# Altium schematic sheet SOM.SchDoc: =SheetTitle_Top
size 420 x 297 mm; EDA_Number: ARTIQ; Author: G.Kasprowicz; CompanyName: WUT ISE; DrawnBy: G.Kasprowicz; Organization: WUT ISE; Address1: PW ISE; Address2: Nowowiejska 15/19 00-665 Warsaw; Address3: gkasprow@gmail.com; ModifiedBy: -; CheckedDate: -; Title2: SOM; DivGrp: WUT ISE; Designer: G.Kasprowicz; ModifiedDate: -; ProjectName: Sensor Box
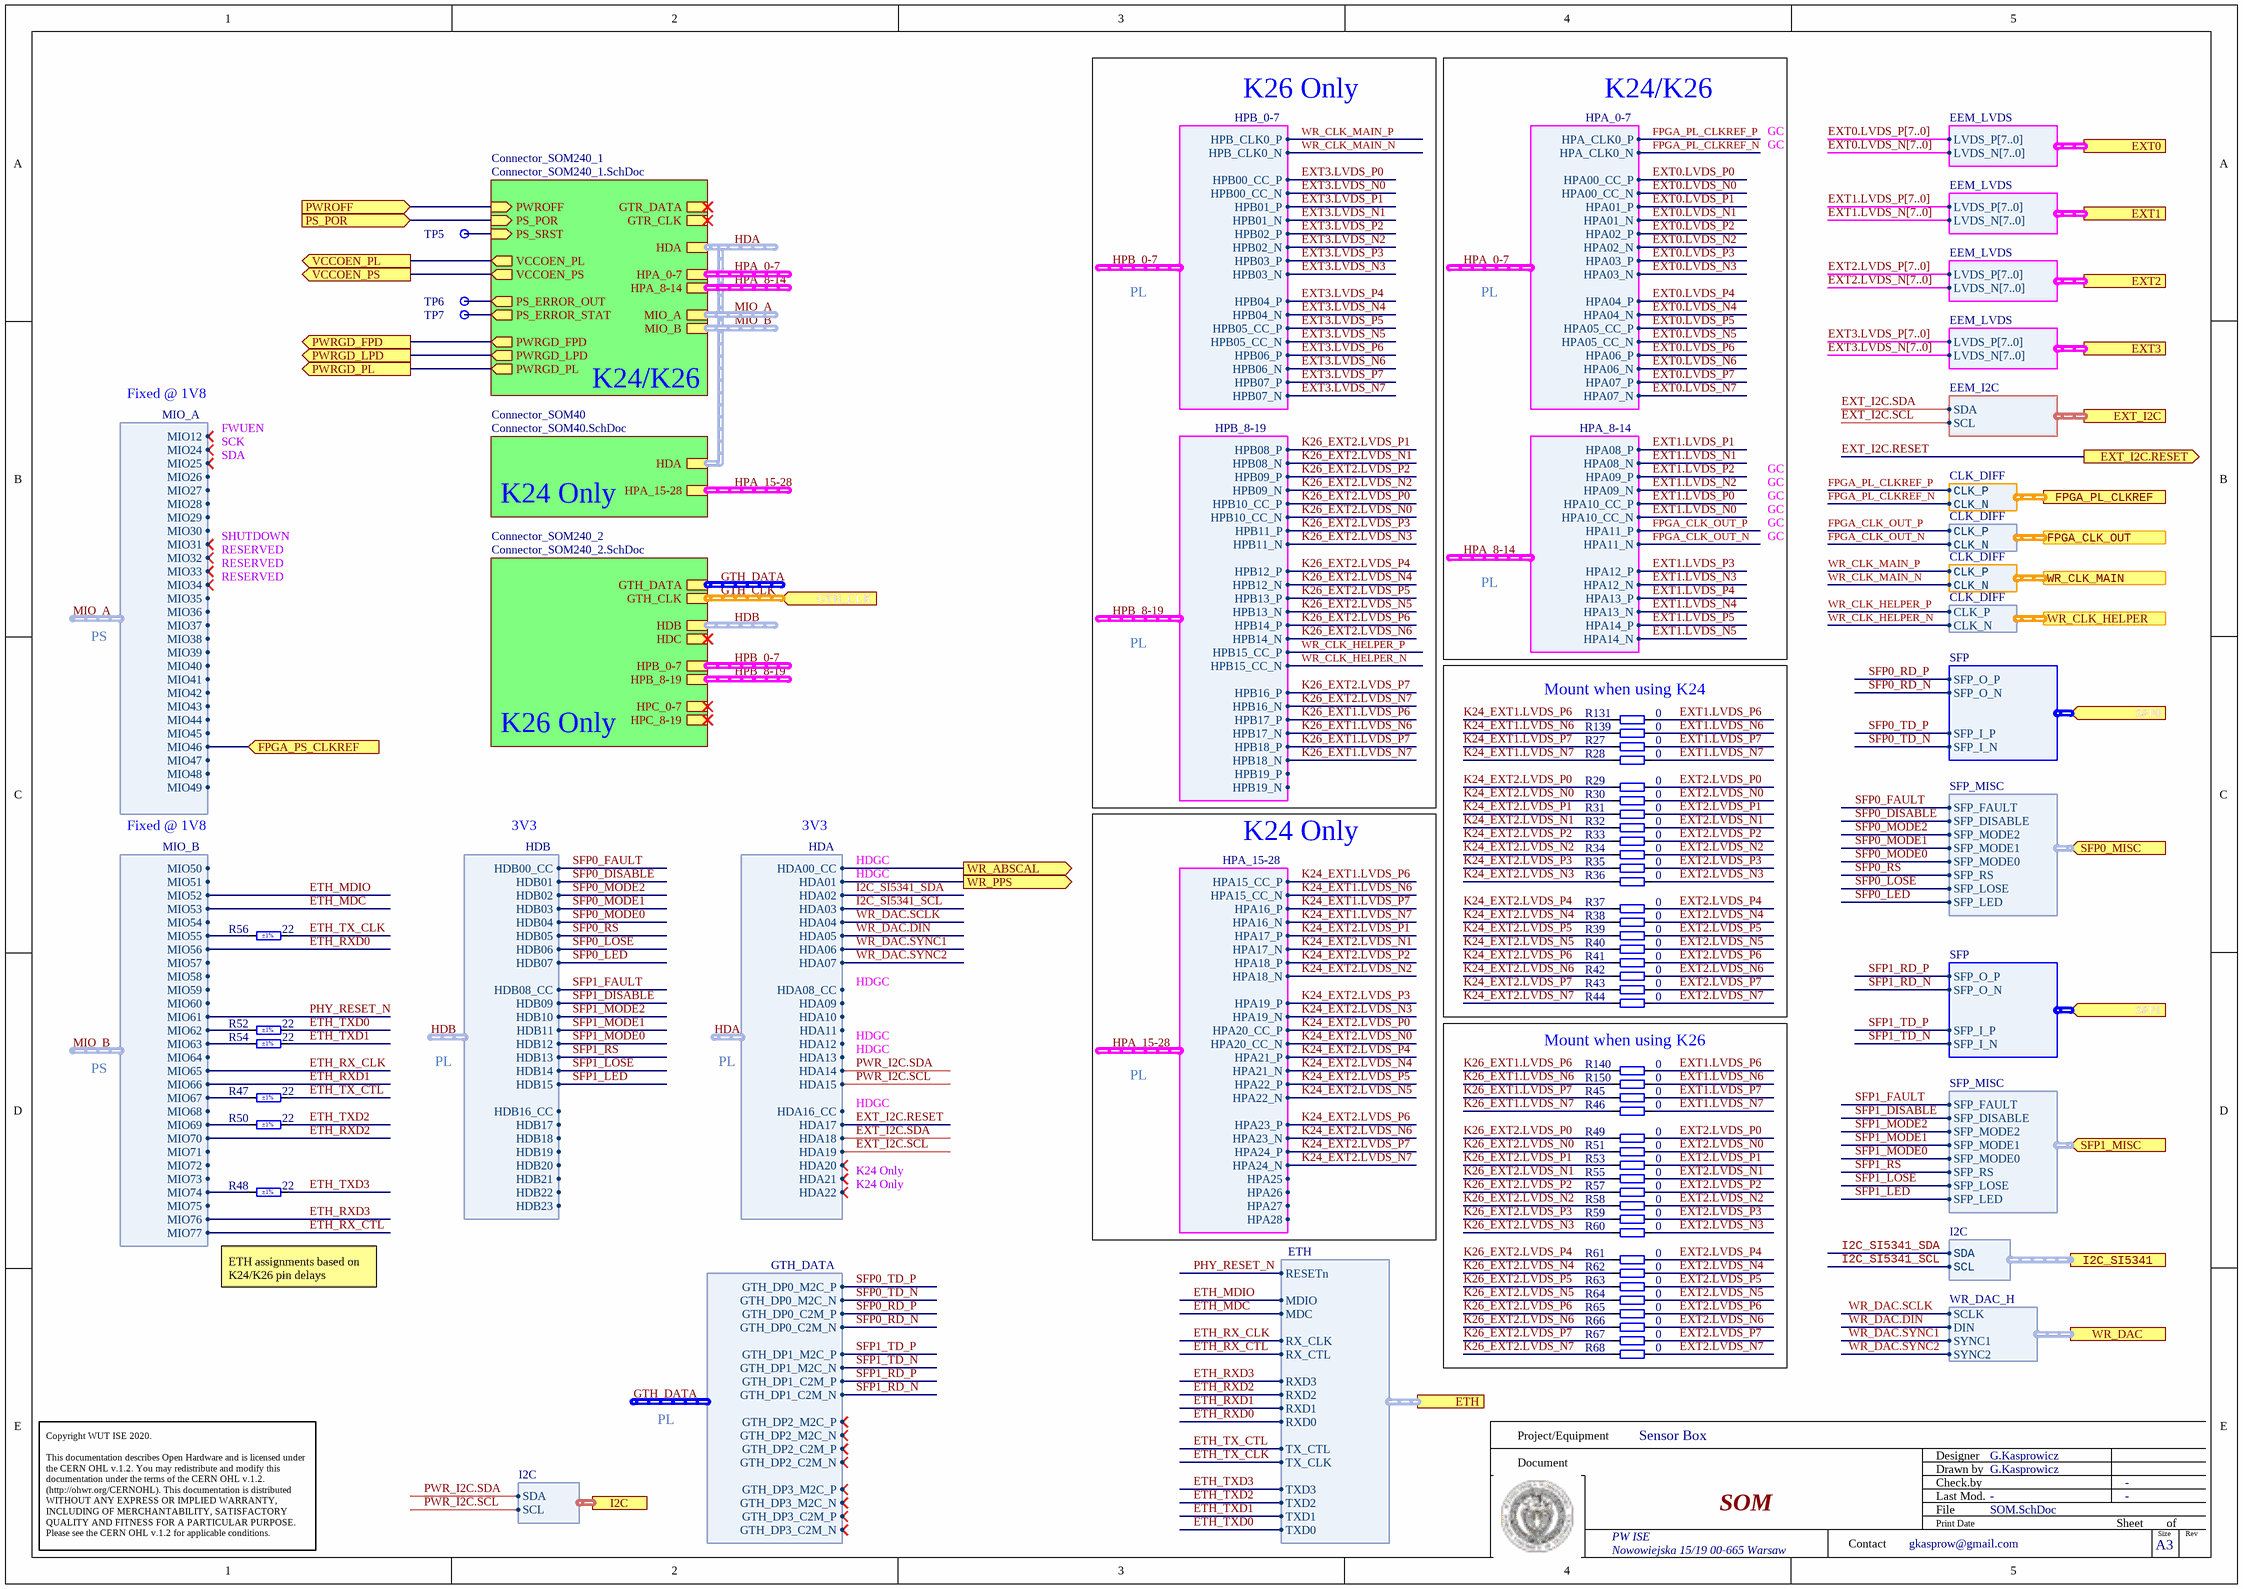
[diagram p0: SOM.SchDoc]

## Parts
R27  0  [RESC1005X40N]
R28  0  [RESC1005X40N]
R29  0  [RESC1005X40N]
R30  0  [RESC1005X40N]
R31  0  [RESC1005X40N]
R32  0  [RESC1005X40N]
R33  0  [RESC1005X40N]
R34  0  [RESC1005X40N]
R35  0  [RESC1005X40N]
R36  0  [RESC1005X40N]
R37  0  [RESC1005X40N]
R38  0  [RESC1005X40N]
R39  0  [RESC1005X40N]
R40  0  [RESC1005X40N]
R41  0  [RESC1005X40N]
R42  0  [RESC1005X40N]
R43  0  [RESC1005X40N]
R44  0  [RESC1005X40N]
R45  0  [RESC1005X40N]
R46  0  [RESC1005X40N]
R47  22  Tolerance: ±1%  [RESC1005X40N]
R48  22  Tolerance: ±1%  [RESC1005X40N]
R49  0  [RESC1005X40N]
R50  22  Tolerance: ±1%  [RESC1005X40N]
R51  0  [RESC1005X40N]
R52  22  Tolerance: ±1%  [RESC1005X40N]
R53  0  [RESC1005X40N]
R54  22  Tolerance: ±1%  [RESC1005X40N]
R55  0  [RESC1005X40N]
R56  22  Tolerance: ±1%  [RESC1005X40N]
R57  0  [RESC1005X40N]
R58  0  [RESC1005X40N]
R59  0  [RESC1005X40N]
R60  0  [RESC1005X40N]
R61  0  [RESC1005X40N]
R62  0  [RESC1005X40N]
R63  0  [RESC1005X40N]
R64  0  [RESC1005X40N]
R65  0  [RESC1005X40N]
R66  0  [RESC1005X40N]
R67  0  [RESC1005X40N]
R68  0  [RESC1005X40N]
R131  0  [RESC1005X40N]
R139  0  [RESC1005X40N]
R140  0  [RESC1005X40N]
R150  0  [RESC1005X40N]
TP5  Test Point  [TPS127]  (value not drawn)  (no BOM)
TP6  Test Point  [TPS127]  (value not drawn)  (no BOM)
TP7  Test Point  [TPS127]  (value not drawn)  (no BOM)

## Blocks framed on the sheet
Mount when using K24: R27-R44 R131 R139
Mount when using K26: R45 R46 R49 R51 R53 R55 R57-R68 R140 R150

## Sub-sheets
Connector_SOM40 = Connector_SOM40.SchDoc: HDA (harness HDA), HPA_15-28 (harness HPA_15-28)
Connector_SOM240_1 = Connector_SOM240_1.SchDoc: VCCOEN_PS (out), VCCOEN_PL (out), PS_ERROR_OUT (out), PS_ERROR_STAT (out), PWROFF (in), PS_POR (in), PS_SRST (in), PWRGD_FPD (out), PWRGD_LPD (out), PWRGD_PL (out), GTR_DATA (harness GTR_DATA), GTR_CLK (harness GTR_CLK), HDA (harness HDA), HPA_0-7 (harness HPA_0-7), HPA_8-14 (harness HPA_8-14), MIO_A (harness MIO_A), MIO_B (harness MIO_B)
Connector_SOM240_2 = Connector_SOM240_2.SchDoc: HDB (harness HDB), HDC (harness HDC), GTH_DATA (harness GTH_DATA), GTH_CLK (harness GTH_CLK), HPB_0-7 (harness HPB_0-7), HPB_8-19 (harness HPB_8-19), HPC_0-7 (harness HPC_0-7), HPC_8-19 (harness HPC_8-19)

## Ports
ETH (harness ETH), EXT0 (harness EEM_LVDS), EXT1 (harness EEM_LVDS), EXT2 (harness EEM_LVDS), EXT3 (harness EEM_LVDS), EXT_I2C (harness EEM_I2C), EXT_I2C.RESET (out), FPGA_CLK_OUT (harness CLK_DIFF), FPGA_PL_CLKREF (harness CLK_DIFF), FPGA_PS_CLKREF (in), GTH_CLK (in, harness GTH_CLK), I2C (harness I2C), I2C_SI5341 (harness I2C), PS_POR (in), PWRGD_FPD (out), PWRGD_LPD (out), PWRGD_PL (out), PWROFF (in), SFP0 (in, harness SFP), SFP0_MISC (in, harness SFP_MISC), SFP1 (in, harness SFP), SFP1_MISC (in, harness SFP_MISC), VCCOEN_PL (out), VCCOEN_PS (out), WR_ABSCAL (out), WR_CLK_HELPER (harness CLK_DIFF), WR_CLK_MAIN (harness CLK_DIFF), WR_DAC (harness WR_DAC_H), WR_PPS (out)

## Harnesses
SFP_MISC: SFP_FAULT, SFP_DISABLE, SFP_MODE2, SFP_MODE1, SFP_MODE0, SFP_RS, SFP_LOSE, SFP_LED
SFP: SFP_O_P, SFP_O_N, SFP_I_P, SFP_I_N
GTH_DATA: GTH_DP0_M2C_P, GTH_DP0_M2C_N, GTH_DP0_C2M_P, GTH_DP0_C2M_N, GTH_DP1_M2C_P, GTH_DP1_M2C_N, GTH_DP1_C2M_P, GTH_DP1_C2M_N, GTH_DP2_M2C_P, GTH_DP2_M2C_N, GTH_DP2_C2M_P, GTH_DP2_C2M_N, GTH_DP3_M2C_P, GTH_DP3_M2C_N, GTH_DP3_C2M_P, GTH_DP3_C2M_N
HPA_0-7: HPA_CLK0_P, HPA_CLK0_N, HPA00_CC_P, HPA00_CC_N, HPA01_P, HPA01_N, HPA02_P, HPA02_N, HPA03_P, HPA03_N, HPA04_P, HPA04_N, HPA05_CC_P, HPA05_CC_N, HPA06_P, HPA06_N, HPA07_P, HPA07_N
HPA_8-14: HPA08_P, HPA08_N, HPA09_P, HPA09_N, HPA10_CC_P, HPA10_CC_N, HPA11_P, HPA11_N, HPA12_P, HPA12_N, HPA13_P, HPA13_N, HPA14_P, HPA14_N
EEM_LVDS: LVDS_N[7..0], LVDS_P[7..0]
EEM_I2C: SCL, SDA
HPB_0-7: HPB_CLK0_P, HPB_CLK0_N, HPB00_CC_P, HPB00_CC_N, HPB01_P, HPB01_N, HPB02_P, HPB02_N, HPB03_P, HPB03_N, HPB04_P, HPB04_N, HPB05_CC_P, HPB05_CC_N, HPB06_P, HPB06_N, HPB07_P, HPB07_N
HPB_8-19: HPB08_P, HPB08_N, HPB09_P, HPB09_N, HPB10_CC_P, HPB10_CC_N, HPB11_P, HPB11_N, HPB12_P, HPB12_N, HPB13_P, HPB13_N, HPB14_P, HPB14_N, HPB15_CC_P, HPB15_CC_N, HPB16_P, HPB16_N, HPB17_P, HPB17_N, HPB18_P, HPB18_N, HPB19_P, HPB19_N
HPA_15-28: HPA15_CC_P, HPA15_CC_N, HPA16_P, HPA16_N, HPA17_P, HPA17_N, HPA18_P, HPA18_N, HPA19_P, HPA19_N, HPA20_CC_P, HPA20_CC_N, HPA21_P, HPA21_N, HPA22_P, HPA22_N, HPA23_P, HPA23_N, HPA24_P, HPA24_N, HPA25, HPA26, HPA27, HPA28
HDA: HDA00_CC, HDA01, HDA02, HDA03, HDA04, HDA06, HDA07, HDA05, HDA08_CC, HDA09, HDA10, HDA11, HDA12, HDA13, HDA14, HDA15, HDA16_CC, HDA17, HDA18, HDA19, HDA20, HDA21, HDA22
ETH: RXD3, RXD2, RX_CLK, RX_CTL, RXD1, RXD0, TX_CTL, TX_CLK, TXD3, TXD2, TXD1, TXD0, MDIO, MDC, RESETn
MIO_A: MIO12, MIO24, MIO25, MIO26, MIO27, MIO28, MIO29, MIO30, MIO31, MIO32, MIO33, MIO34, MIO35, MIO36, MIO37, MIO38, MIO39, MIO40, MIO41, MIO42, MIO43, MIO44, MIO45, MIO46, MIO47, MIO48, MIO49
CLK_DIFF: CLK_N, CLK_P
CLK_DIFF: CLK_P, CLK_N
I2C: SCL, SDA
WR_DAC_H: SYNC1, SCLK, SYNC2, DIN
HDB: HDB00_CC, HDB01, HDB02, HDB03, HDB04, HDB05, HDB06, HDB07, HDB08_CC, HDB09, HDB10, HDB11, HDB12, HDB13, HDB14, HDB15, HDB16_CC, HDB17, HDB18, HDB19, HDB20, HDB21, HDB22, HDB23
MIO_B: MIO50, MIO51, MIO52, MIO53, MIO54, MIO55, MIO56, MIO57, MIO58, MIO59, MIO60, MIO61, MIO62, MIO63, MIO64, MIO65, MIO66, MIO67, MIO68, MIO69, MIO70, MIO71, MIO72, MIO73, MIO74, MIO75, MIO76, MIO77

## Nets
ETH_MDC: port ETH.MDC, sheet Connector_SOM240_1/MIO_B.MIO53
ETH_MDIO: port ETH.MDIO, sheet Connector_SOM240_1/MIO_B.MIO52
ETH_RX_CLK: port ETH.RX_CLK, sheet Connector_SOM240_1/MIO_B.MIO65
ETH_RX_CTL: port ETH.RX_CTL, sheet Connector_SOM240_1/MIO_B.MIO77
ETH_RXD0: port ETH.RXD0, sheet Connector_SOM240_1/MIO_B.MIO56
ETH_RXD1: port ETH.RXD1, sheet Connector_SOM240_1/MIO_B.MIO66
ETH_RXD2: port ETH.RXD2, sheet Connector_SOM240_1/MIO_B.MIO70
ETH_RXD3: port ETH.RXD3, sheet Connector_SOM240_1/MIO_B.MIO76
ETH_TX_CLK: R56.2 ; port ETH.TX_CLK
ETH_TX_CTL: R47.2 ; port ETH.TX_CTL
ETH_TXD0: R52.2 ; port ETH.TXD0
ETH_TXD1: R54.2 ; port ETH.TXD1
ETH_TXD2: R50.2 ; port ETH.TXD2
ETH_TXD3: R48.2 ; port ETH.TXD3
EXT0.LVDS_N0: sheet Connector_SOM240_1/HPA_0-7.HPA00_CC_N
EXT0.LVDS_N1: sheet Connector_SOM240_1/HPA_0-7.HPA01_N
EXT0.LVDS_N2: sheet Connector_SOM240_1/HPA_0-7.HPA02_N
EXT0.LVDS_N3: sheet Connector_SOM240_1/HPA_0-7.HPA03_N
EXT0.LVDS_N4: sheet Connector_SOM240_1/HPA_0-7.HPA04_N
EXT0.LVDS_N5: sheet Connector_SOM240_1/HPA_0-7.HPA05_CC_N
EXT0.LVDS_N6: sheet Connector_SOM240_1/HPA_0-7.HPA06_N
EXT0.LVDS_N7: sheet Connector_SOM240_1/HPA_0-7.HPA07_N
EXT0.LVDS_P0: sheet Connector_SOM240_1/HPA_0-7.HPA00_CC_P
EXT0.LVDS_P1: sheet Connector_SOM240_1/HPA_0-7.HPA01_P
EXT0.LVDS_P2: sheet Connector_SOM240_1/HPA_0-7.HPA02_P
EXT0.LVDS_P3: sheet Connector_SOM240_1/HPA_0-7.HPA03_P
EXT0.LVDS_P4: sheet Connector_SOM240_1/HPA_0-7.HPA04_P
EXT0.LVDS_P5: sheet Connector_SOM240_1/HPA_0-7.HPA05_CC_P
EXT0.LVDS_P6: sheet Connector_SOM240_1/HPA_0-7.HPA06_P
EXT0.LVDS_P7: sheet Connector_SOM240_1/HPA_0-7.HPA07_P
EXT1.LVDS_N0: sheet Connector_SOM240_1/HPA_8-14.HPA10_CC_N
EXT1.LVDS_N1: sheet Connector_SOM240_1/HPA_8-14.HPA08_N
EXT1.LVDS_N2: sheet Connector_SOM240_1/HPA_8-14.HPA09_N
EXT1.LVDS_N3: sheet Connector_SOM240_1/HPA_8-14.HPA12_N
EXT1.LVDS_N4: sheet Connector_SOM240_1/HPA_8-14.HPA13_N
EXT1.LVDS_N5: sheet Connector_SOM240_1/HPA_8-14.HPA14_N
EXT1.LVDS_N6: R139.2 R150.2
EXT1.LVDS_N7: R28.2 R46.2
EXT1.LVDS_P0: sheet Connector_SOM240_1/HPA_8-14.HPA10_CC_P
EXT1.LVDS_P1: sheet Connector_SOM240_1/HPA_8-14.HPA08_P
EXT1.LVDS_P2: sheet Connector_SOM240_1/HPA_8-14.HPA09_P
EXT1.LVDS_P3: sheet Connector_SOM240_1/HPA_8-14.HPA12_P
EXT1.LVDS_P4: sheet Connector_SOM240_1/HPA_8-14.HPA13_P
EXT1.LVDS_P5: sheet Connector_SOM240_1/HPA_8-14.HPA14_P
EXT1.LVDS_P6: R131.2 R140.2
EXT1.LVDS_P7: R27.2 R45.2
EXT2.LVDS_N0: R30.2 R51.2
EXT2.LVDS_N1: R32.2 R55.2
EXT2.LVDS_N2: R34.2 R58.2
EXT2.LVDS_N3: R36.2 R60.2
EXT2.LVDS_N4: R38.2 R62.2
EXT2.LVDS_N5: R40.2 R64.2
EXT2.LVDS_N6: R42.2 R66.2
EXT2.LVDS_N7: R44.2 R68.2
EXT2.LVDS_P0: R29.2 R49.2
EXT2.LVDS_P1: R31.2 R53.2
EXT2.LVDS_P2: R33.2 R57.2
EXT2.LVDS_P3: R35.2 R59.2
EXT2.LVDS_P4: R37.2 R61.2
EXT2.LVDS_P5: R39.2 R63.2
EXT2.LVDS_P6: R41.2 R65.2
EXT2.LVDS_P7: R43.2 R67.2
EXT3.LVDS_N0: sheet Connector_SOM240_2/HPB_0-7.HPB00_CC_N
EXT3.LVDS_N1: sheet Connector_SOM240_2/HPB_0-7.HPB01_N
EXT3.LVDS_N2: sheet Connector_SOM240_2/HPB_0-7.HPB02_N
EXT3.LVDS_N3: sheet Connector_SOM240_2/HPB_0-7.HPB03_N
EXT3.LVDS_N4: sheet Connector_SOM240_2/HPB_0-7.HPB04_N
EXT3.LVDS_N5: sheet Connector_SOM240_2/HPB_0-7.HPB05_CC_N
EXT3.LVDS_N6: sheet Connector_SOM240_2/HPB_0-7.HPB06_N
EXT3.LVDS_N7: sheet Connector_SOM240_2/HPB_0-7.HPB07_N
EXT3.LVDS_P0: sheet Connector_SOM240_2/HPB_0-7.HPB00_CC_P
EXT3.LVDS_P1: sheet Connector_SOM240_2/HPB_0-7.HPB01_P
EXT3.LVDS_P2: sheet Connector_SOM240_2/HPB_0-7.HPB02_P
EXT3.LVDS_P3: sheet Connector_SOM240_2/HPB_0-7.HPB03_P
EXT3.LVDS_P4: sheet Connector_SOM240_2/HPB_0-7.HPB04_P
EXT3.LVDS_P5: sheet Connector_SOM240_2/HPB_0-7.HPB05_CC_P
EXT3.LVDS_P6: sheet Connector_SOM240_2/HPB_0-7.HPB06_P
EXT3.LVDS_P7: sheet Connector_SOM240_2/HPB_0-7.HPB07_P
EXT_I2C.RESET: port EXT_I2C.RESET, sheet Connector_SOM240_1/HDA.HDA17
EXT_I2C.SCL: port EXT_I2C.SCL, sheet Connector_SOM240_1/HDA.HDA19
EXT_I2C.SDA: port EXT_I2C.SDA, sheet Connector_SOM240_1/HDA.HDA18
FPGA_CLK_OUT_N: sheet Connector_SOM240_1/HPA_8-14.HPA11_N, port FPGA_CLK_OUT.CLK_N
FPGA_CLK_OUT_P: sheet Connector_SOM240_1/HPA_8-14.HPA11_P, port FPGA_CLK_OUT.CLK_P
FPGA_PL_CLKREF_N: sheet Connector_SOM240_1/HPA_0-7.HPA_CLK0_N, port FPGA_PL_CLKREF.CLK_N
FPGA_PL_CLKREF_P: sheet Connector_SOM240_1/HPA_0-7.HPA_CLK0_P, port FPGA_PL_CLKREF.CLK_P
HDA.HDA00_CC: port WR_ABSCAL, sheet Connector_SOM240_1/HDA.HDA00_CC
HDA.HDA01: port WR_PPS, sheet Connector_SOM240_1/HDA.HDA01
I2C_SI5341_SCL: sheet Connector_SOM240_1/HDA.HDA03, port I2C_SI5341.SCL  [project net HDA.HDA03]
I2C_SI5341_SDA: sheet Connector_SOM240_1/HDA.HDA02, port I2C_SI5341.SDA  [project net HDA.HDA02]
K24_EXT1.LVDS_N6: R139.1 ; sheet Connector_SOM40/HPA_15-28.HPA15_CC_N  [project net HPA_15-28.HPA15_CC_N]
K24_EXT1.LVDS_N7: R28.1 ; sheet Connector_SOM40/HPA_15-28.HPA16_N  [project net HPA_15-28.HPA16_N]
K24_EXT1.LVDS_P6: R131.1 ; sheet Connector_SOM40/HPA_15-28.HPA15_CC_P  [project net HPA_15-28.HPA15_CC_P]
K24_EXT1.LVDS_P7: R27.1 ; sheet Connector_SOM40/HPA_15-28.HPA16_P  [project net HPA_15-28.HPA16_P]
K24_EXT2.LVDS_N0: R30.1 ; sheet Connector_SOM40/HPA_15-28.HPA20_CC_N  [project net HPA_15-28.HPA20_CC_N]
K24_EXT2.LVDS_N1: R32.1 ; sheet Connector_SOM40/HPA_15-28.HPA17_N  [project net HPA_15-28.HPA17_N]
K24_EXT2.LVDS_N2: R34.1 ; sheet Connector_SOM40/HPA_15-28.HPA18_N  [project net HPA_15-28.HPA18_N]
K24_EXT2.LVDS_N3: R36.1 ; sheet Connector_SOM40/HPA_15-28.HPA19_N  [project net HPA_15-28.HPA19_N]
K24_EXT2.LVDS_N4: R38.1 ; sheet Connector_SOM40/HPA_15-28.HPA21_N  [project net HPA_15-28.HPA21_N]
K24_EXT2.LVDS_N5: R40.1 ; sheet Connector_SOM40/HPA_15-28.HPA22_N  [project net HPA_15-28.HPA22_N]
K24_EXT2.LVDS_N6: R42.1 ; sheet Connector_SOM40/HPA_15-28.HPA23_N  [project net HPA_15-28.HPA23_N]
K24_EXT2.LVDS_N7: R44.1 ; sheet Connector_SOM40/HPA_15-28.HPA24_N  [project net HPA_15-28.HPA24_N]
K24_EXT2.LVDS_P0: R29.1 ; sheet Connector_SOM40/HPA_15-28.HPA20_CC_P  [project net HPA_15-28.HPA20_CC_P]
K24_EXT2.LVDS_P1: R31.1 ; sheet Connector_SOM40/HPA_15-28.HPA17_P  [project net HPA_15-28.HPA17_P]
K24_EXT2.LVDS_P2: R33.1 ; sheet Connector_SOM40/HPA_15-28.HPA18_P  [project net HPA_15-28.HPA18_P]
K24_EXT2.LVDS_P3: R35.1 ; sheet Connector_SOM40/HPA_15-28.HPA19_P  [project net HPA_15-28.HPA19_P]
K24_EXT2.LVDS_P4: R37.1 ; sheet Connector_SOM40/HPA_15-28.HPA21_P  [project net HPA_15-28.HPA21_P]
K24_EXT2.LVDS_P5: R39.1 ; sheet Connector_SOM40/HPA_15-28.HPA22_P  [project net HPA_15-28.HPA22_P]
K24_EXT2.LVDS_P6: R41.1 ; sheet Connector_SOM40/HPA_15-28.HPA23_P  [project net HPA_15-28.HPA23_P]
K24_EXT2.LVDS_P7: R43.1 ; sheet Connector_SOM40/HPA_15-28.HPA24_P  [project net HPA_15-28.HPA24_P]
K26_EXT1.LVDS_N6: R150.1 ; sheet Connector_SOM240_2/HPB_8-19.HPB17_N  [project net HPB_8-19.HPB17_N]
K26_EXT1.LVDS_N7: R46.1 ; sheet Connector_SOM240_2/HPB_8-19.HPB18_N  [project net HPB_8-19.HPB18_N]
K26_EXT1.LVDS_P6: R140.1 ; sheet Connector_SOM240_2/HPB_8-19.HPB17_P  [project net HPB_8-19.HPB17_P]
K26_EXT1.LVDS_P7: R45.1 ; sheet Connector_SOM240_2/HPB_8-19.HPB18_P  [project net HPB_8-19.HPB18_P]
K26_EXT2.LVDS_N0: R51.1 ; sheet Connector_SOM240_2/HPB_8-19.HPB10_CC_N  [project net HPB_8-19.HPB10_CC_N]
K26_EXT2.LVDS_N1: R55.1 ; sheet Connector_SOM240_2/HPB_8-19.HPB08_N  [project net HPB_8-19.HPB08_N]
K26_EXT2.LVDS_N2: R58.1 ; sheet Connector_SOM240_2/HPB_8-19.HPB09_N  [project net HPB_8-19.HPB09_N]
K26_EXT2.LVDS_N3: R60.1 ; sheet Connector_SOM240_2/HPB_8-19.HPB11_N  [project net HPB_8-19.HPB11_N]
K26_EXT2.LVDS_N4: R62.1 ; sheet Connector_SOM240_2/HPB_8-19.HPB12_N  [project net HPB_8-19.HPB12_N]
K26_EXT2.LVDS_N5: R64.1 ; sheet Connector_SOM240_2/HPB_8-19.HPB13_N  [project net HPB_8-19.HPB13_N]
K26_EXT2.LVDS_N6: R66.1 ; sheet Connector_SOM240_2/HPB_8-19.HPB14_N  [project net HPB_8-19.HPB14_N]
K26_EXT2.LVDS_N7: R68.1 ; sheet Connector_SOM240_2/HPB_8-19.HPB16_N  [project net HPB_8-19.HPB16_N]
K26_EXT2.LVDS_P0: R49.1 ; sheet Connector_SOM240_2/HPB_8-19.HPB10_CC_P  [project net HPB_8-19.HPB10_CC_P]
K26_EXT2.LVDS_P1: R53.1 ; sheet Connector_SOM240_2/HPB_8-19.HPB08_P  [project net HPB_8-19.HPB08_P]
K26_EXT2.LVDS_P2: R57.1 ; sheet Connector_SOM240_2/HPB_8-19.HPB09_P  [project net HPB_8-19.HPB09_P]
K26_EXT2.LVDS_P3: R59.1 ; sheet Connector_SOM240_2/HPB_8-19.HPB11_P  [project net HPB_8-19.HPB11_P]
K26_EXT2.LVDS_P4: R61.1 ; sheet Connector_SOM240_2/HPB_8-19.HPB12_P  [project net HPB_8-19.HPB12_P]
K26_EXT2.LVDS_P5: R63.1 ; sheet Connector_SOM240_2/HPB_8-19.HPB13_P  [project net HPB_8-19.HPB13_P]
K26_EXT2.LVDS_P6: R65.1 ; sheet Connector_SOM240_2/HPB_8-19.HPB14_P  [project net HPB_8-19.HPB14_P]
K26_EXT2.LVDS_P7: R67.1 ; sheet Connector_SOM240_2/HPB_8-19.HPB16_P  [project net HPB_8-19.HPB16_P]
MIO_A.MIO46: port FPGA_PS_CLKREF, sheet Connector_SOM240_1/MIO_A.MIO46
MIO_B.MIO55: R56.1 ; sheet Connector_SOM240_1/MIO_B.MIO55
MIO_B.MIO62: R52.1 ; sheet Connector_SOM240_1/MIO_B.MIO62
MIO_B.MIO63: R54.1 ; sheet Connector_SOM240_1/MIO_B.MIO63
MIO_B.MIO67: R47.1 ; sheet Connector_SOM240_1/MIO_B.MIO67
MIO_B.MIO69: R50.1 ; sheet Connector_SOM240_1/MIO_B.MIO69
MIO_B.MIO74: R48.1 ; sheet Connector_SOM240_1/MIO_B.MIO74
PHY_RESET_N: port ETH.RESETn, sheet Connector_SOM240_1/MIO_B.MIO61  [project net MIO_B.MIO61]
PS_POR: port PS_POR, sheet Connector_SOM240_1/PS_POR
PWR_I2C.SCL: sheet Connector_SOM240_1/HDA.HDA15, port I2C.SCL  [project net HDA.HDA15]
PWR_I2C.SDA: sheet Connector_SOM240_1/HDA.HDA14, port I2C.SDA  [project net HDA.HDA14]
PWRGD_FPD: port PWRGD_FPD, sheet Connector_SOM240_1/PWRGD_FPD
PWRGD_LPD: port PWRGD_LPD, sheet Connector_SOM240_1/PWRGD_LPD
PWRGD_PL: port PWRGD_PL, sheet Connector_SOM240_1/PWRGD_PL
PWROFF: port PWROFF, sheet Connector_SOM240_1/PWROFF
SFP0_DISABLE: port SFP0_MISC.SFP_DISABLE, sheet Connector_SOM240_2/HDB.HDB01  [project net HDB.HDB01]
SFP0_FAULT: port SFP0_MISC.SFP_FAULT, sheet Connector_SOM240_2/HDB.HDB00_CC  [project net HDB.HDB00_CC]
SFP0_LED: port SFP0_MISC.SFP_LED, sheet Connector_SOM240_2/HDB.HDB07  [project net HDB.HDB07]
SFP0_LOSE: port SFP0_MISC.SFP_LOSE, sheet Connector_SOM240_2/HDB.HDB06  [project net HDB.HDB06]
SFP0_MODE0: port SFP0_MISC.SFP_MODE0, sheet Connector_SOM240_2/HDB.HDB04  [project net HDB.HDB04]
SFP0_MODE1: port SFP0_MISC.SFP_MODE1, sheet Connector_SOM240_2/HDB.HDB03  [project net HDB.HDB03]
SFP0_MODE2: port SFP0_MISC.SFP_MODE2, sheet Connector_SOM240_2/HDB.HDB02  [project net HDB.HDB02]
SFP0_RD_N: port SFP0.SFP_O_N, sheet Connector_SOM240_2/GTH_DATA.GTH_DP0_C2M_N  [project net GTH_DATA.GTH_DP0_C2M_N]
SFP0_RD_P: port SFP0.SFP_O_P, sheet Connector_SOM240_2/GTH_DATA.GTH_DP0_C2M_P  [project net GTH_DATA.GTH_DP0_C2M_P]
SFP0_RS: port SFP0_MISC.SFP_RS, sheet Connector_SOM240_2/HDB.HDB05  [project net HDB.HDB05]
SFP0_TD_N: port SFP0.SFP_I_N, sheet Connector_SOM240_2/GTH_DATA.GTH_DP0_M2C_N  [project net GTH_DATA.GTH_DP0_M2C_N]
SFP0_TD_P: port SFP0.SFP_I_P, sheet Connector_SOM240_2/GTH_DATA.GTH_DP0_M2C_P  [project net GTH_DATA.GTH_DP0_M2C_P]
SFP1_DISABLE: port SFP1_MISC.SFP_DISABLE, sheet Connector_SOM240_2/HDB.HDB09  [project net HDB.HDB09]
SFP1_FAULT: port SFP1_MISC.SFP_FAULT, sheet Connector_SOM240_2/HDB.HDB08_CC  [project net HDB.HDB08_CC]
SFP1_LED: port SFP1_MISC.SFP_LED, sheet Connector_SOM240_2/HDB.HDB15  [project net HDB.HDB15]
SFP1_LOSE: port SFP1_MISC.SFP_LOSE, sheet Connector_SOM240_2/HDB.HDB14  [project net HDB.HDB14]
SFP1_MODE0: port SFP1_MISC.SFP_MODE0, sheet Connector_SOM240_2/HDB.HDB12  [project net HDB.HDB12]
SFP1_MODE1: port SFP1_MISC.SFP_MODE1, sheet Connector_SOM240_2/HDB.HDB11  [project net HDB.HDB11]
SFP1_MODE2: port SFP1_MISC.SFP_MODE2, sheet Connector_SOM240_2/HDB.HDB10  [project net HDB.HDB10]
SFP1_RD_N: port SFP1.SFP_O_N, sheet Connector_SOM240_2/GTH_DATA.GTH_DP1_C2M_N  [project net GTH_DATA.GTH_DP1_C2M_N]
SFP1_RD_P: port SFP1.SFP_O_P, sheet Connector_SOM240_2/GTH_DATA.GTH_DP1_C2M_P  [project net GTH_DATA.GTH_DP1_C2M_P]
SFP1_RS: port SFP1_MISC.SFP_RS, sheet Connector_SOM240_2/HDB.HDB13  [project net HDB.HDB13]
SFP1_TD_N: port SFP1.SFP_I_N, sheet Connector_SOM240_2/GTH_DATA.GTH_DP1_M2C_N  [project net GTH_DATA.GTH_DP1_M2C_N]
SFP1_TD_P: port SFP1.SFP_I_P, sheet Connector_SOM240_2/GTH_DATA.GTH_DP1_M2C_P  [project net GTH_DATA.GTH_DP1_M2C_P]
VCCOEN_PL: port VCCOEN_PL, sheet Connector_SOM240_1/VCCOEN_PL
VCCOEN_PS: port VCCOEN_PS, sheet Connector_SOM240_1/VCCOEN_PS
WR_CLK_HELPER_N: sheet Connector_SOM240_2/HPB_8-19.HPB15_CC_N, port WR_CLK_HELPER.CLK_N  [project net HPB_8-19.HPB15_CC_N]
WR_CLK_HELPER_P: sheet Connector_SOM240_2/HPB_8-19.HPB15_CC_P, port WR_CLK_HELPER.CLK_P  [project net HPB_8-19.HPB15_CC_P]
WR_CLK_MAIN_N: sheet Connector_SOM240_2/HPB_0-7.HPB_CLK0_N, port WR_CLK_MAIN.CLK_N  [project net HPB_0-7.HPB_CLK0_N]
WR_CLK_MAIN_P: sheet Connector_SOM240_2/HPB_0-7.HPB_CLK0_P, port WR_CLK_MAIN.CLK_P  [project net HPB_0-7.HPB_CLK0_P]
WR_DAC.DIN: sheet Connector_SOM240_1/HDA.HDA05, port WR_DAC.DIN  [project net HDA.HDA05]
WR_DAC.SCLK: sheet Connector_SOM240_1/HDA.HDA04, port WR_DAC.SCLK  [project net HDA.HDA04]
WR_DAC.SYNC1: sheet Connector_SOM240_1/HDA.HDA06, port WR_DAC.SYNC1  [project net HDA.HDA06]
WR_DAC.SYNC2: sheet Connector_SOM240_1/HDA.HDA07, port WR_DAC.SYNC2  [project net HDA.HDA07]
NetTP5_1: TP5.1 ; sheet Connector_SOM240_1/PS_SRST
NetTP6_1: TP6.1 ; sheet Connector_SOM240_1/PS_ERROR_OUT
NetTP7_1: TP7.1 ; sheet Connector_SOM240_1/PS_ERROR_STAT

## Buses and harness runs
bus EXT0.LVDS_N[7..0]
bus EXT0.LVDS_P[7..0]
bus EXT1.LVDS_N[7..0]
bus EXT1.LVDS_P[7..0]
bus EXT2.LVDS_N[7..0]
bus EXT2.LVDS_P[7..0]
bus EXT3.LVDS_N[7..0]
bus EXT3.LVDS_P[7..0]
harness GTH_CLK = port GTH_CLK = sheet Connector_SOM240_2/GTH_CLK
harness GTH_DATA = sheet Connector_SOM240_2/GTH_DATA
harness HDA = sheet Connector_SOM40/HDA = sheet Connector_SOM240_1/HDA
harness HDB = sheet Connector_SOM240_2/HDB
harness HPA_0-7 = sheet Connector_SOM240_1/HPA_0-7
harness HPA_8-14 = sheet Connector_SOM240_1/HPA_8-14
harness HPA_15-28 = sheet Connector_SOM40/HPA_15-28
harness HPB_0-7 = sheet Connector_SOM240_2/HPB_0-7
harness HPB_8-19 = sheet Connector_SOM240_2/HPB_8-19
harness MIO_A = sheet Connector_SOM240_1/MIO_A
harness MIO_B = sheet Connector_SOM240_1/MIO_B

## Notes on the sheet
- K26 Only
- K24/K26
- GC
- PL
- Fixed @ 1V8
- FWUEN
- SCK
- SDA
- K24 Only
- RESERVED
- SHUTDOWN
- PS
- 3V3
- HDGC
- ETH assignments based on K24/K26 pin delays
- Project/Equipment
- Document
- Designer
- Drawn by
- Check.by
- Copyright WUT ISE 2020.
  This documentation describes Open Hardware and is licensed under the CERN OHL v.1.2. You may redistribute and modify this documentation under the terms of the CERN OHL v.1.2. (http://ohwr.org/CERNOHL). This documentation is distributed WITHOUT ANY EXPRESS OR IMPLIED WARRANTY, INCLUDING OF MERCHANTABILITY, SATISFACTORY QUALITY AND FITNESS FOR A PARTICULAR PURPOSE. Please see the CERN OHL v.1.2 for applicable conditions.
- Contact
- File
- Last Mod.
- Print Date
- Sheet
- Size
- A3
- of
- Rev

## Library data of the parts
R27-R46 R49 R51 R53 R55 R57-R68 R131 R139 R140 R150 = R0402_0R_JUMPER: Resistor; Part Description: 1A (0.05R Max DC Resistance) Zero Ohm Jumper; Manufacturer: GENERIC; Manufacturer1 Part Number: 232270591001L; PressFit: No; Part Number: R0402_0R_JUMPER; Component Kind: Standard; Component Type: Standard; Pin Count: 2; Value: 0; Status: Not Recommended; Manufacturer Part Number: R0402_0R_JUMPER; Case: 0402; Mounted: Yes; Sense: No; Socket: No; SMD: Yes; Manufacturer1 Example: YAGEO PHYCOMP; Manufacturer1 ComponentHeight: 0.4mm; HelpURL: \\cern.ch\dfs\Applications\Altium\Datasheets\R0402_Phycomp_RC0402.pdf; Author: CERN DEM JLC; CreateDate: 03.12.2007; LatestRevisionDate: 17.10.2012
R47 R48 R50 R52 R54 R56 = R0402_22R_1%_0.0625W_100PPM: Resistor - 1%; Part Description: General Purpose Thick Film Chip Resistor; Manufacturer: GENERIC; Manufacturer1 Part Number: 232270672209L; TC: ±100ppm/°C; PressFit: No; Part Number: R0402_22R_1%_0.0625W_100PPM; Component Kind: Standard; Component Type: Standard; Pin Count: 2; Value: 22; Status: Not Recommended; Power: 0.0625W; Manufacturer Part Number: R0402_22R_1%_0.0625W_100PPM; Case: 0402; Mounted: Yes; Sense: No; Socket: No; SMD: Yes; Manufacturer1 Example: YAGEO PHYCOMP; Manufacturer1 ComponentHeight: 0.4mm; HelpURL: \\cern.ch\dfs\Applications\Altium\Datasheets\R0402_Phycomp_RC0402.pdf; Author: CERN DEM JLC; CreateDate: 03.12.2007; LatestRevisionDate: 17.10.2012
TP5-TP7 = SMD_PAD_1.27X1.27MM: Part Description: 1.27mm x 1.27mm PCB Copper Area (SMD Test Point); Mounted: No; Part Number: SMD_PAD_1.27X1.27MM; Component Type: Standard (No BOM); Pin Count: 1; Family: Test Point; Socket: No; SMD: Yes; Sense: No; Status: None; ComponentHeight: 0mm; HelpURL: Undefined; Author: CERN DEM JLC; CreateDate: 12.01.2008; LatestRevisionDate: 12.01.2008; PackageDescription: 1.27mm x 1.27mm PCB Copper Area (SMD Test Point)